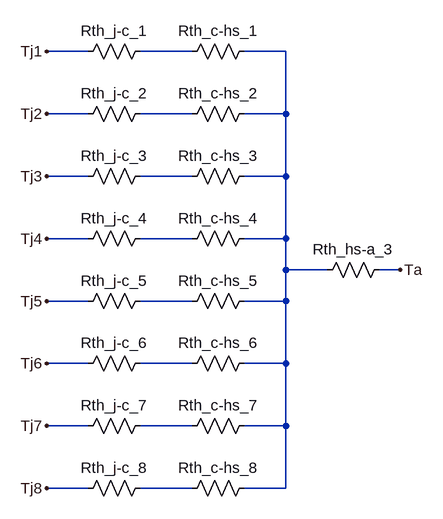
[diagram p0: schematic Draft1.asc]
Draft1.asc, the LTspice schematic file:
Version 4
SHEET 1 880 908
WIRE 80 176 16 176
WIRE 240 176 160 176
WIRE 384 176 320 176
WIRE 80 272 16 272
WIRE 240 272 160 272
WIRE 384 272 384 176
WIRE 384 272 320 272
WIRE 80 368 16 368
WIRE 240 368 160 368
WIRE 384 368 384 272
WIRE 384 368 320 368
WIRE 80 464 16 464
WIRE 240 464 160 464
WIRE 384 464 384 368
WIRE 384 464 320 464
WIRE 384 512 384 464
WIRE 448 512 384 512
WIRE 560 512 528 512
WIRE 80 560 16 560
WIRE 240 560 160 560
WIRE 384 560 384 512
WIRE 384 560 320 560
WIRE 80 656 16 656
WIRE 240 656 160 656
WIRE 384 656 384 560
WIRE 384 656 320 656
WIRE 80 752 16 752
WIRE 240 752 160 752
WIRE 384 752 384 656
WIRE 384 752 320 752
WIRE 80 848 16 848
WIRE 240 848 160 848
WIRE 384 848 384 752
WIRE 384 848 320 848
FLAG 16 176 Tj1
FLAG 16 272 Tj2
FLAG 16 368 Tj3
FLAG 16 464 Tj4
FLAG 16 560 Tj5
FLAG 16 656 Tj6
FLAG 16 752 Tj7
FLAG 16 848 Tj8
FLAG 560 512 Ta
SYMBOL res 176 160 R90
WINDOW 0 0 56 VBottom 2
WINDOW 3 32 56 VTop 2
SYMATTR InstName Rth_j-c_1
SYMATTR Value ""
SYMBOL res 336 160 R90
WINDOW 0 0 56 VBottom 2
WINDOW 3 32 56 VTop 2
SYMATTR InstName Rth_c-hs_1
SYMATTR Value ""
SYMBOL res 544 496 R90
WINDOW 0 0 56 VBottom 2
WINDOW 3 32 56 VTop 2
SYMATTR InstName Rth_hs-a_3
SYMATTR Value ""
SYMBOL res 176 256 R90
WINDOW 0 0 56 VBottom 2
WINDOW 3 32 56 VTop 2
SYMATTR InstName Rth_j-c_2
SYMATTR Value ""
SYMBOL res 336 256 R90
WINDOW 0 0 56 VBottom 2
WINDOW 3 32 56 VTop 2
SYMATTR InstName Rth_c-hs_2
SYMATTR Value ""
SYMBOL res 176 352 R90
WINDOW 0 0 56 VBottom 2
WINDOW 3 32 56 VTop 2
SYMATTR InstName Rth_j-c_3
SYMATTR Value ""
SYMBOL res 336 352 R90
WINDOW 0 0 56 VBottom 2
WINDOW 3 32 56 VTop 2
SYMATTR InstName Rth_c-hs_3
SYMATTR Value ""
SYMBOL res 176 448 R90
WINDOW 0 0 56 VBottom 2
WINDOW 3 32 56 VTop 2
SYMATTR InstName Rth_j-c_4
SYMATTR Value ""
SYMBOL res 336 448 R90
WINDOW 0 0 56 VBottom 2
WINDOW 3 32 56 VTop 2
SYMATTR InstName Rth_c-hs_4
SYMATTR Value ""
SYMBOL res 176 544 R90
WINDOW 0 0 56 VBottom 2
WINDOW 3 32 56 VTop 2
SYMATTR InstName Rth_j-c_5
SYMATTR Value ""
SYMBOL res 336 544 R90
WINDOW 0 0 56 VBottom 2
WINDOW 3 32 56 VTop 2
SYMATTR InstName Rth_c-hs_5
SYMATTR Value ""
SYMBOL res 176 640 R90
WINDOW 0 0 56 VBottom 2
WINDOW 3 32 56 VTop 2
SYMATTR InstName Rth_j-c_6
SYMATTR Value ""
SYMBOL res 336 640 R90
WINDOW 0 0 56 VBottom 2
WINDOW 3 32 56 VTop 2
SYMATTR InstName Rth_c-hs_6
SYMATTR Value ""
SYMBOL res 176 736 R90
WINDOW 0 0 56 VBottom 2
WINDOW 3 32 56 VTop 2
SYMATTR InstName Rth_j-c_7
SYMATTR Value ""
SYMBOL res 336 736 R90
WINDOW 0 0 56 VBottom 2
WINDOW 3 32 56 VTop 2
SYMATTR InstName Rth_c-hs_7
SYMATTR Value ""
SYMBOL res 176 832 R90
WINDOW 0 0 56 VBottom 2
WINDOW 3 32 56 VTop 2
SYMATTR InstName Rth_j-c_8
SYMATTR Value ""
SYMBOL res 336 832 R90
WINDOW 0 0 56 VBottom 2
WINDOW 3 32 56 VTop 2
SYMATTR InstName Rth_c-hs_8
SYMATTR Value ""

The netlist it stands for:
* Draft1.asc
Rth_j-c_1 N001 Tj1
Rth_c-hs_1 N002 N001
Rth_hs-a_3 Ta N002
Rth_j-c_2 N003 Tj2
Rth_c-hs_2 N002 N003
Rth_j-c_3 N004 Tj3
Rth_c-hs_3 N002 N004
Rth_j-c_4 N005 Tj4
Rth_c-hs_4 N002 N005
Rth_j-c_5 N006 Tj5
Rth_c-hs_5 N002 N006
Rth_j-c_6 N007 Tj6
Rth_c-hs_6 N002 N007
Rth_j-c_7 N008 Tj7
Rth_c-hs_7 N002 N008
Rth_j-c_8 N009 Tj8
Rth_c-hs_8 N002 N009
.backanno
.end